# EAGLE design SparkFun_MIDI_Shield-v13 (EAGLE 5.11)
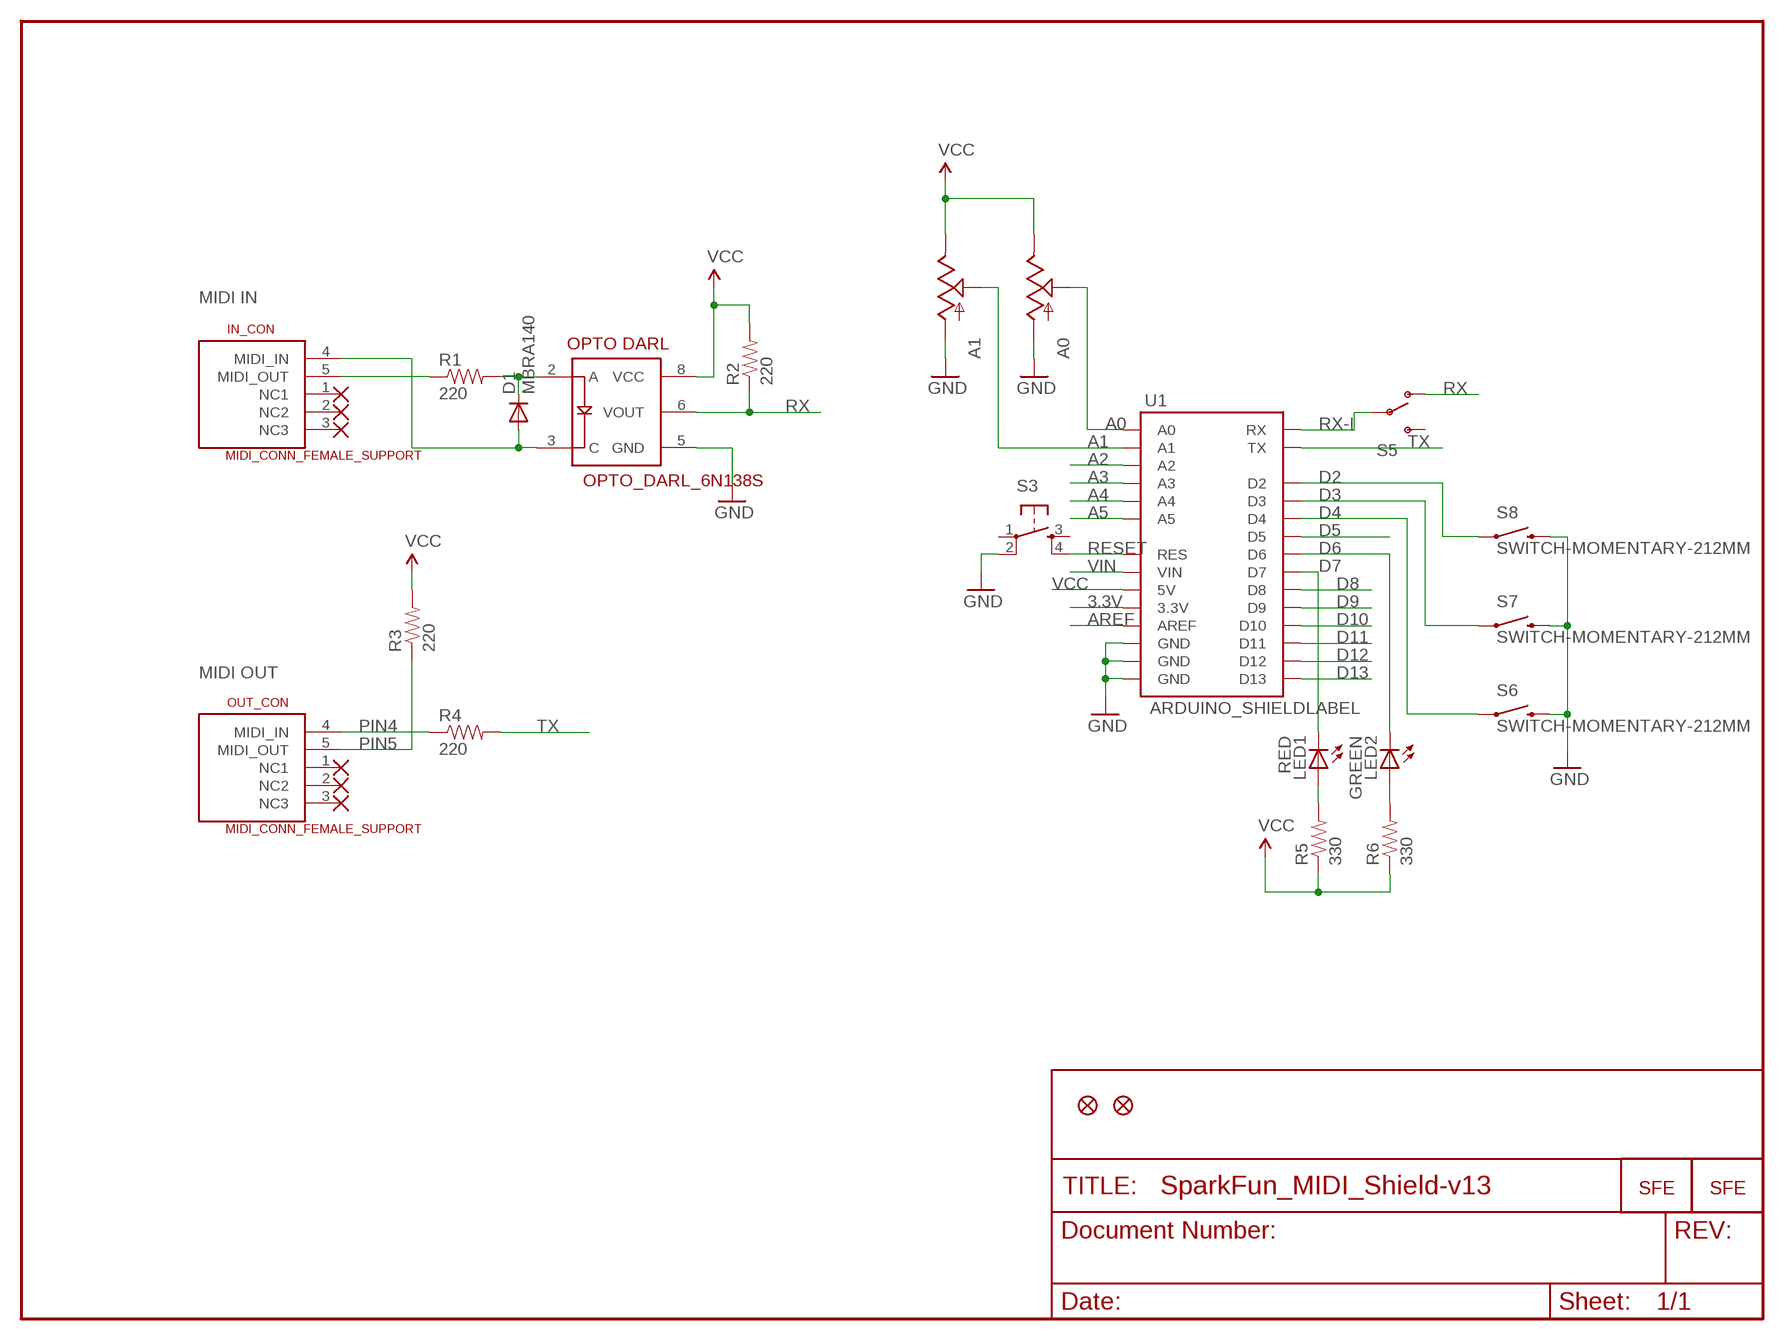
[diagram p0: schematic, sheet 1]

## Parts
A0  POT  [ALPS_POT]
A1  POT  [ALPS_POT]
D1  MBRA140  DIODESMA  [SMA-DIODE]
IN_CON  MIDI_CONN_FEMALE_SUPPORT  [DIN_5_FEMALE_SUPPORT]
JP1  FIDUCIAL1X2  [FIDUCIAL-1X2]
JP2  FIDUCIAL1X2  [FIDUCIAL-1X2]
JP3  LOGO-SFENEW  [SFE-NEW-WEBLOGO]
JP4  LOGO-SFESK  [SFE-LOGO-FLAME]
LED1  RED  LED0603  [LED-0603]
LED2  GREEN  LED0603  [LED-0603]
OUT_CON  MIDI_CONN_FEMALE_SUPPORT  [DIN_5_FEMALE_SUPPORT]
R1  220  RESISTOR0402-RES  [0402-RES]
R2  220  RESISTOR0402-RES  [0402-RES]
R3  220  RESISTOR0402-RES  [0402-RES]
R4  220  RESISTOR0402-RES  [0402-RES]
R5  330  RESISTOR0402-RES  [0402-RES]
R6  330  RESISTOR0402-RES  [0402-RES]
S3  TAC_SWITCHSMD  [TACTILE_SWITCH_SMD]
S5  SWITCH-SPSTSMD  [AYZ0202]
S6  SWITCH-MOMENTARY-212MM  [TACTILE-PTH-12MM]
S7  SWITCH-MOMENTARY-212MM  [TACTILE-PTH-12MM]
S8  SWITCH-MOMENTARY-212MM  [TACTILE-PTH-12MM]
U1  ARDUINO_SHIELDLABEL  [DUEMILANOVE_SHIELD]
U$6  OPTO_DARL_6N138S  [8-SMD]

## Nets
3.3V: U1.3.3V
56: D1.C R1.2 U$6.2(A)
1235: OUT_CON.5(MIDI_OUT) R3.1
A0: A0.P$2(S) U1.A0
A1: A1.P$2(S) U1.A1
A2: U1.A2
A3: U1.A3
A4: U1.A4
A5: U1.A5
AREF: U1.AREF
D2: S8.1 U1.D2
D3: S7.1 U1.D3
D4: S6.1 U1.D4
D5: U1.D5
D6: LED2.C U1.D6
D7: LED1.C U1.D7
D8: U1.D8
D9: U1.D9
D10: U1.D10
D11: U1.D11
D12: U1.D12
D13: U1.D13
GND: A0.P$3(A) A1.P$3(A) S3.2 S6.3 S7.3 S8.3 U1.GND@0(GND) U1.GND@1(GND) U1.GND@2(GND) U$6.5(GND)
N$8: OUT_CON.4(MIDI_IN) R4.1
N$9: LED1.A R5.2
N$10: LED2.A R6.2
N$13: IN_CON.5(MIDI_OUT) R1.1
PIN5: D1.A IN_CON.4(MIDI_IN) U$6.3(C)
RESET: S3.4 U1.RES
RX: R2.1 S5.1(O) U$6.6(VOUT)
RX-I: S5.2(P) U1.RX
TX: R4.2 U1.TX
VCC: A0.P$1(E) A1.P$1(E) R2.2 R3.2 R5.1 R6.1 U1.5V U$6.8(VCC)
VIN: U1.VIN
Unconnected: IN_CON.1(NC1) IN_CON.2(NC2) IN_CON.3(NC3) OUT_CON.1(NC1) OUT_CON.2(NC2) OUT_CON.3(NC3) S3.1 S3.3 S5.3(S)

## Notes on the sheet
- MIDI IN
- MIDI OUT
- PIN4
- PIN5

## Library data of the parts
A0 A1 = SparkFun:POT
D1 = SparkFun:DIODE: Diode These are standard reverse protection diodes and small signal diodes. SMA package can handle up to about 1A. SOD-323 can handle about 200mA. What the SOD-323 package when ordering, there are some mfgs out there that are 5-pin packages.
IN_CON OUT_CON = SparkFun:MIDI_CONN_FEMALE_SUPPORT
JP1 JP2 = SparkFun:FIDUCIAL: Fiducial Alignment Points Various fiducial points for machine vision alignment.
JP3 JP4 = SparkFun:LOGO-SFE: Spark Fun Electronics PCB Logo This is the standard Spark Fun Electronics PCB logo.
LED1 LED2 = SparkFun:LED: LEDs Standard schematic elements and footprints for 5mm, 3mm, 1206, and 0603 sized LEDs. 5mm - Spark Fun Electronics SKU : COM-00529 (and others)
R1-R6 = SparkFun:RESISTOR: Resistor Basic schematic elements and footprints for 0603, 1206, and PTH 1/10th watt (small) resistors.
S3 = SparkFun:TAC_SWITCH: Momentary Switch Button commonly used for reset or general input. Spark Fun Electronics SKU : COM-00097
S5 = SparkFun:SWITCH-SPST: SPST Switch Simple slide switch. Spark Fun Electronics SKU : COM-00102
S6-S8 = SparkFun:SWITCH-MOMENTARY-2
U1 = SparkFun:ARDUINO_SHIELD
U$6 = SparkFun:OPTO_DARL_6N138S

## Board
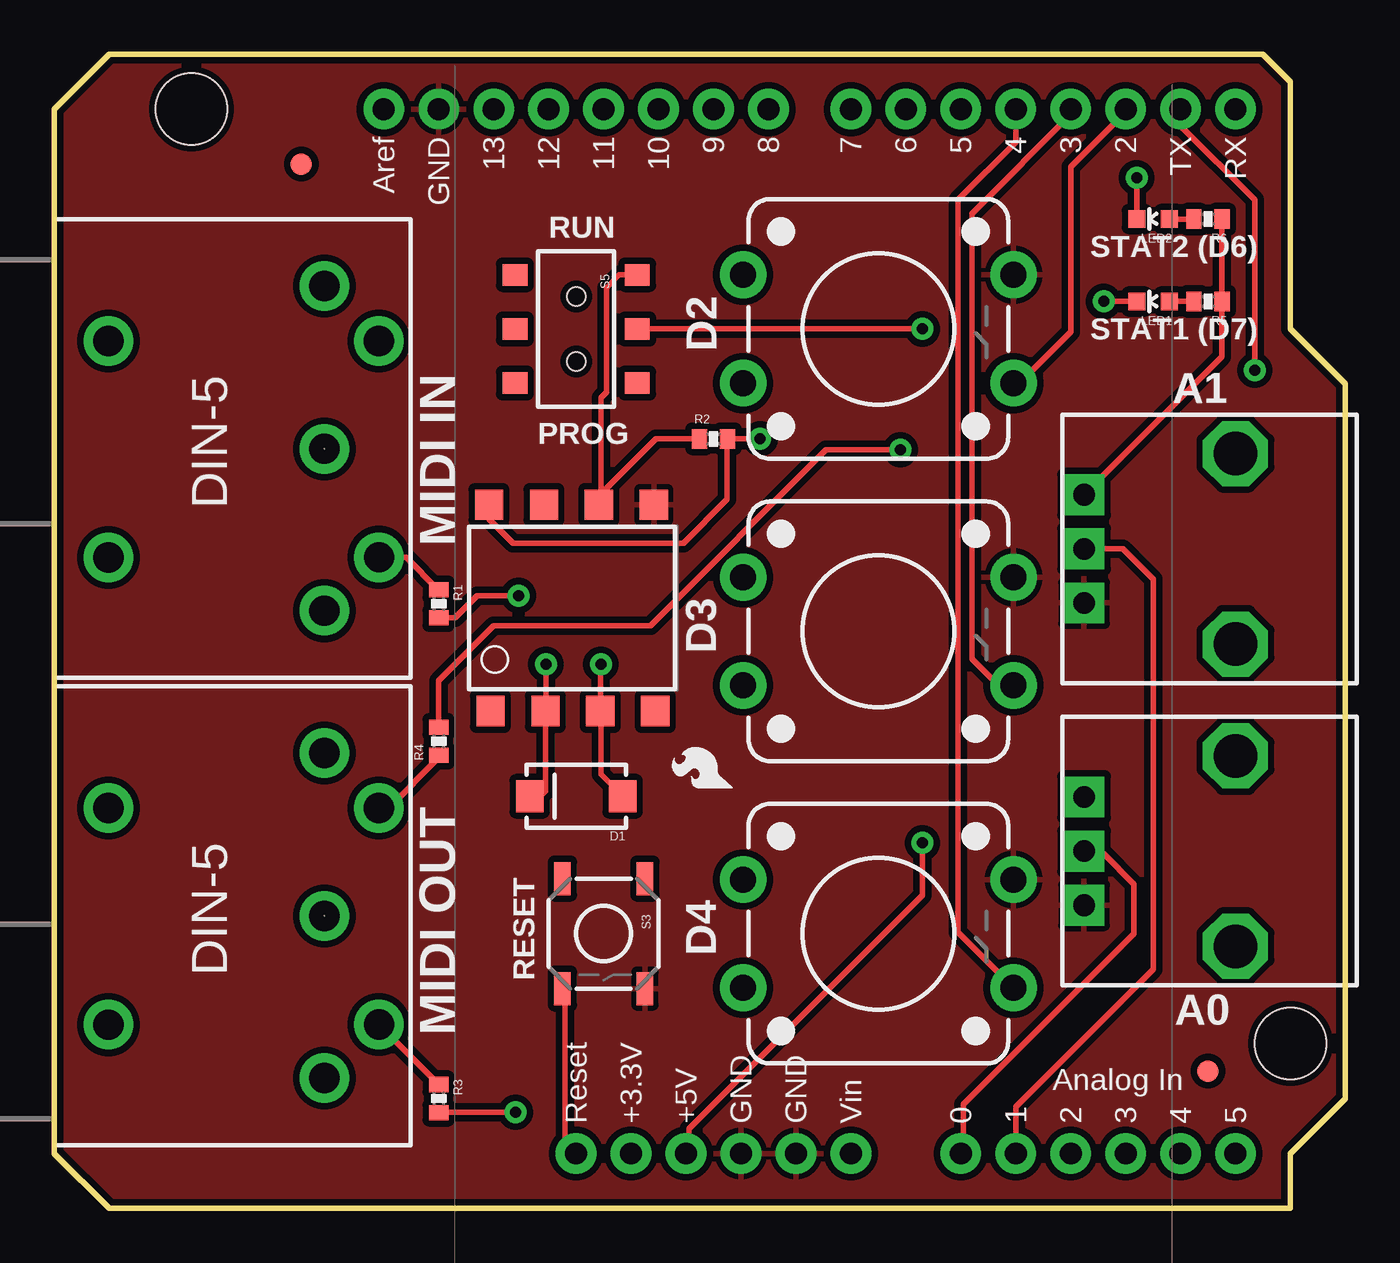
[diagram p1: board, top side]
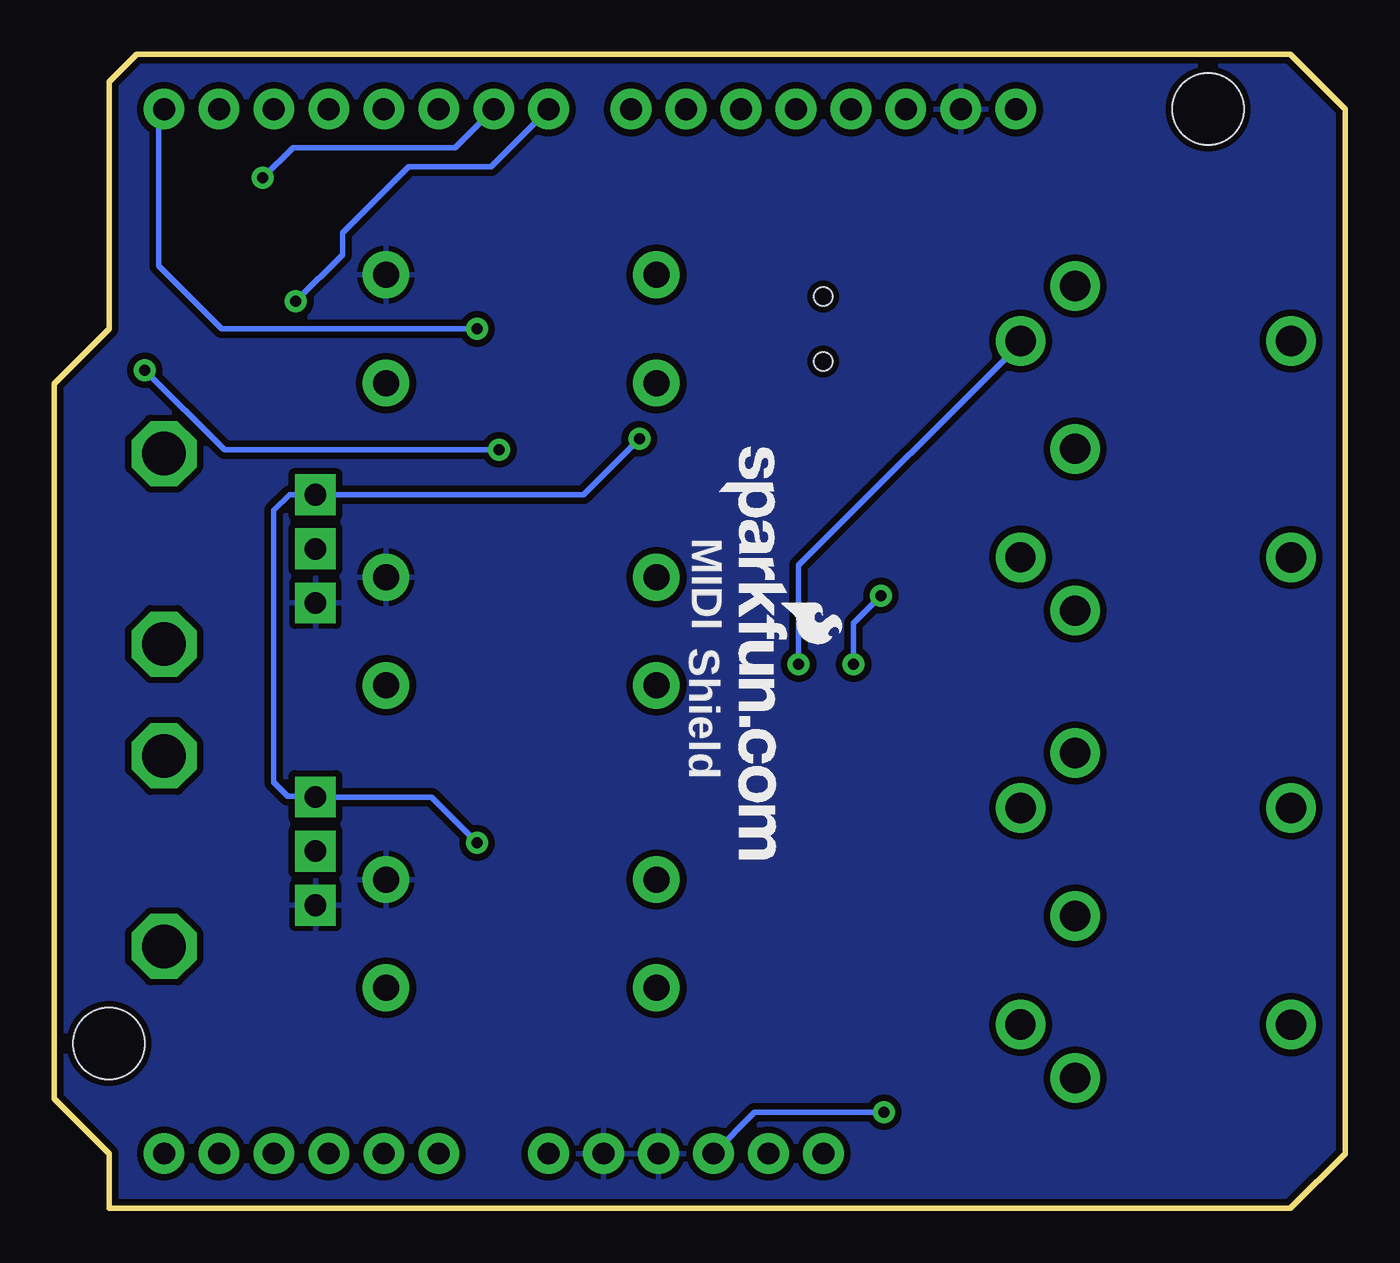
[diagram p2: board, bottom side, seen from below]

Size 59.69 x 53.34 mm. Coordinates in mm from the lower left corner, seen from the top.
Outline: 0,2.54 0,50.8 2.54,53.34 55.88,53.34 57.15,52.07 57.15,40.64 59.69,38.1 59.69,5.08 57.15,2.54 57.15,0 2.54,0 0,2.54
Copper layers (1*16): Top 0.035mm / dielectric 1.5mm / Bottom 0.035mm
Design rules "SparkFun *": minimum track width 8mil, minimum drill 20mil, track to track 8mil, track to pad 8mil, pad to pad 8mil, via to via 8mil, smd to smd 8mil, copper to edge 9mil, drill to drill 8mil, minimum pad ring 12mil, minimum via ring 10mil, stop-mask expansion 4mil, vias tented up to drill 20mil, thermal gap 10mil

### Footprints (pad centres in the part's own frame; a part is rotated, then mirrored left to right if it is on the bottom)
ALPS_POT = drill 1 pad 1.88 square: P$1 7,-2.5; P$2 7,0; P$3 7,2.5 | drill 2 octagon: P$4 0,-4.4; P$5 0,4.4
SMA-DIODE = smd 1.27 x 1.47: A -2.15,0; C 2.15,0
DIN_5_FEMALE_SUPPORT = drill 1.4 pad 2.286 round: 1 0.46,3.61; 2 -7.07,3.6; 3 7.94,3.6; 4 -4.53,6.12; 5 5.47,6.13; 6 -4.53,-6.382; 7 5.478,-6.382
FIDUCIAL-1X2 = smd 1 x 1: 1 0,0
LED-0603 = smd 0.8 x 0.8: A 0,-0.75; C 0,0.75
0402-RES = smd 0.7 x 0.9: 1 -0.65,0; 2 0.65,0
TACTILE_SWITCH_SMD = smd 1.524 x 0.762: 1 -2.54,1.905; 2 2.54,1.905; 3 -2.54,-1.905; 4 2.54,-1.905
AYZ0202 = smd 1 x 1.15: 1 -2.5,2.825; 2 0,2.825; 3 2.5,2.825; 4 -2.5,-2.825; 5 0,-2.825; 6 2.5,-2.825 | hole 0.85: 1.5,0; -1.5,0
TACTILE-PTH-12MM = drill 1.2 pad 2.159 round: 1 6.25,-2.5; 2 -6.25,-2.5; 3 6.25,2.5; 4 -6.25,2.5
DUEMILANOVE_SHIELD = drill 1.016 pad 1.88 round: 3.3V 50.8,26.67; 5V 50.8,29.21; A0 50.8,41.91; A1 50.8,44.45; A2 50.8,46.99; A3 50.8,49.53; A4 50.8,52.07; A5 50.8,54.61; AREF 2.54,15.24; D2 2.54,49.53; D3 2.54,46.99; D4 2.54,44.45; D5 2.54,41.91; D6 2.54,39.37; D7 2.54,36.83; D8 2.54,33.02; D9 2.54,30.48; D10 2.54,27.94; D11 2.54,25.4; D12 2.54,22.86; D13 2.54,20.32; GND@0 50.8,31.75; GND@1 50.8,34.29; GND@2 2.54,17.78; RES 50.8,24.13; RX 2.54,54.61; TX 2.54,52.07; VIN 50.8,36.83 | hole 3.302: 45.72,57.15; 2.54,6.35
8-SMD = smd 1.3 x 1.4: 1 -3.96,-4.96; 2 -1.42,-4.96; 3 1.12,-4.96; 4 3.66,-4.96; 5 3.59,4.58; 6 1.05,4.58; 7 -1.49,4.58; 8 -4.03,4.58

### Placement (x,y rotation side)
A0  54.61,16.51 180 top
A1  54.61,30.48 180 top
D1  24.13,19.05 180 top
IN_CON  8.89,35.56 270 top
JP1  11.43,48.26 0 top
JP2  53.34,6.35 0 top
JP3  28.96,35.18 270 bottom
JP4  31.37,19.43 90 top
LED1  50.8,41.91 90 top
LED2  50.8,45.72 90 top
OUT_CON  8.89,13.97 270 top
R1  17.78,27.94 270 top
R2  30.48,35.56 0 top
R3  17.78,5.08 270 top
R4  17.78,21.59 90 top
R5  53.34,41.91 180 top
R6  53.34,45.72 180 top
S3  25.4,12.7 270 top
S5  24.13,40.64 270 top
S6  38.1,12.7 0 top
S7  38.1,26.67 0 top
S8  38.1,40.64 0 top
U1  0,53.34 270 top
U$6  24.13,27.94 0 top

### Tracks (layer width: path | path; a pad name or v marks a point on that pad's centre or on a via)
56  (via drill 0.51)
  Top 0.254: D1.C 21.98,18.79 22.1,18.67 22.71,19.28 U$6.2 22.73,23 v22.73,25.15 | v21.46,28.32 19.56,28.32 18.54,27.3 17.78,27.3 R1.2
  Bottom 0.254: v22.73,25.15 22.73,27.05 v21.46,28.32
1235
  Top 0.254: 15.11,8.59 15.11,8.76 | OUT_CON.5 15.11,8.59 | R3.1 15.11,8.4 15.11,8.59
A0
  Top 0.254: U1.A0 41.91,2.67 42.04,2.79 42.04,4.83 49.91,12.7 49.91,14.99 48.51,16.38 47.75,16.38 47.62,16.51 A0.P$2
A1
  Top 0.254: A1.P$2 49.4,30.48 50.8,29.08 50.8,11.05 44.45,4.7 U1.A1
D2
  Top 0.254: S8.1 44.62,38.14 46.99,40.51 46.99,48.13 49.53,50.67 U1.D2
D3
  Top 0.254: S7.1 43.65,24.17 42.42,25.4 42.42,45.97 47.12,50.67 U1.D3
D4
  Top 0.254: S6.1 41.78,12.77 41.78,46.61 44.45,49.28 U1.D4
D6  (via drill 0.51)
  Top 0.254: LED2.C 50.04,45.73 v50.04,47.62
  Bottom 0.254: v50.04,47.62 48.64,49.02 41.15,49.02 U1.D6
D7  (via drill 0.51)
  Top 0.254: v48.51,41.91 LED1.C
  Bottom 0.254: U1.D7 39.5,48.13 43.31,48.13 46.35,45.09 46.35,44.07 v48.51,41.91
GND
  pour Bottom (isolate 0.305): 0,50.8 2.54,53.34 55.88,53.34 57.15,52.07 57.15,40.64 59.69,38.1 59.69,5.08 57.15,2.54 57.15,0 2.54,0 0,2.54
  pour Top (isolate 0.305): 0,50.8 2.54,53.34 55.88,53.34 57.15,52.07 57.15,40.64 59.69,38.1 59.69,5.08 57.15,2.54 57.15,0 2.54,0 0,2.54
N$8
  Top 0.254: R4.1 17.78,20.83 15.45,18.5 OUT_CON.4
N$9
  Top 0.254: LED1.A R5.2
N$10
  Top 0.254: LED2.A R6.2
N$13
  Top 0.254: R1.1 17.78,28.57 16.27,30.09 IN_CON.5
PIN5  (via drill 0.51)
  Top 0.254: D1.A 25.27,20.06 25.27,22.99 U$6.3 25.25,25 v25.27,25.15
  Bottom 0.254: IN_CON.4 15.01,40.03 14.99,40.01 25.27,29.72 v25.27,25.15
RESET
  Top 0.254: S3.4 23.62,10.29 23.62,3.05 U1.RES
RX
  Top 0.254: S5.1 26.12,43.14 25.53,42.55 25.53,37.72 25.27,37.47 25.27,32.77 25.03,32.52 | 25.15,32.52 25.15,32.51 | U$6.6 25.15,32.52 | 25.15,32.52 25.53,32.89 | U$6.6 25.18,32.6 25.02,32.77 27.81,35.56 R2.1 | 25.03,32.52 25.02,32.51 | U$6.6 25.03,32.52
RX-I  (via drill 0.51)
  Top 0.254: S5.2 v40.13,40.64
  Bottom 0.254: v40.13,40.64 51.94,40.64 54.86,43.56 54.86,50.42 54.61,50.67 U1.RX
TX  (via drill 0.51)
  Top 0.254: U1.TX 52.07,50.04 55.5,46.61 v55.5,38.73 | v39.12,35.05 35.69,35.05 27.56,26.92 20.32,26.92 17.78,24.38 R4.2
  Bottom 0.254: v55.5,38.73 51.82,35.05 v39.12,35.05
VCC  (via drill 0.51)
  Top 0.254: R6.1 53.98,45.72 53.98,41.92 R5.1 53.98,41.91 53.98,39.34 A1.P$1 | R2.2 31.11,35.56 | v32.64,35.56 R2.2 | U$6.8 20.1,31.84 21.21,30.73 29.08,30.73 31.11,32.77 31.11,35.31 31.24,35.43 31.13,35.55 R2.2 | R3.2 17.78,4.45 v21.34,4.45 | v40.13,16.89 40.13,14.48 29.34,3.68 29.34,2.54 29.21,2.41 U1.5V
  Bottom 0.254: v32.64,35.56 35.22,32.98 A1.P$1 48.81,32.98 49.53,32.26 49.53,19.68 48.9,19.05 47.75,19.05 47.71,19.01 A0.P$1 42.25,19.01 v40.13,16.89 | U1.5V 27.3,4.45 v21.34,4.45

### Text on the board
tPlace: RUN | STAT2 (D6) | D2 | STAT1 (D7) | A1 | PROG | MIDI IN | D3 | D4 | RESET | A0 | MIDI OUT
bPlace: MIDI | Shield